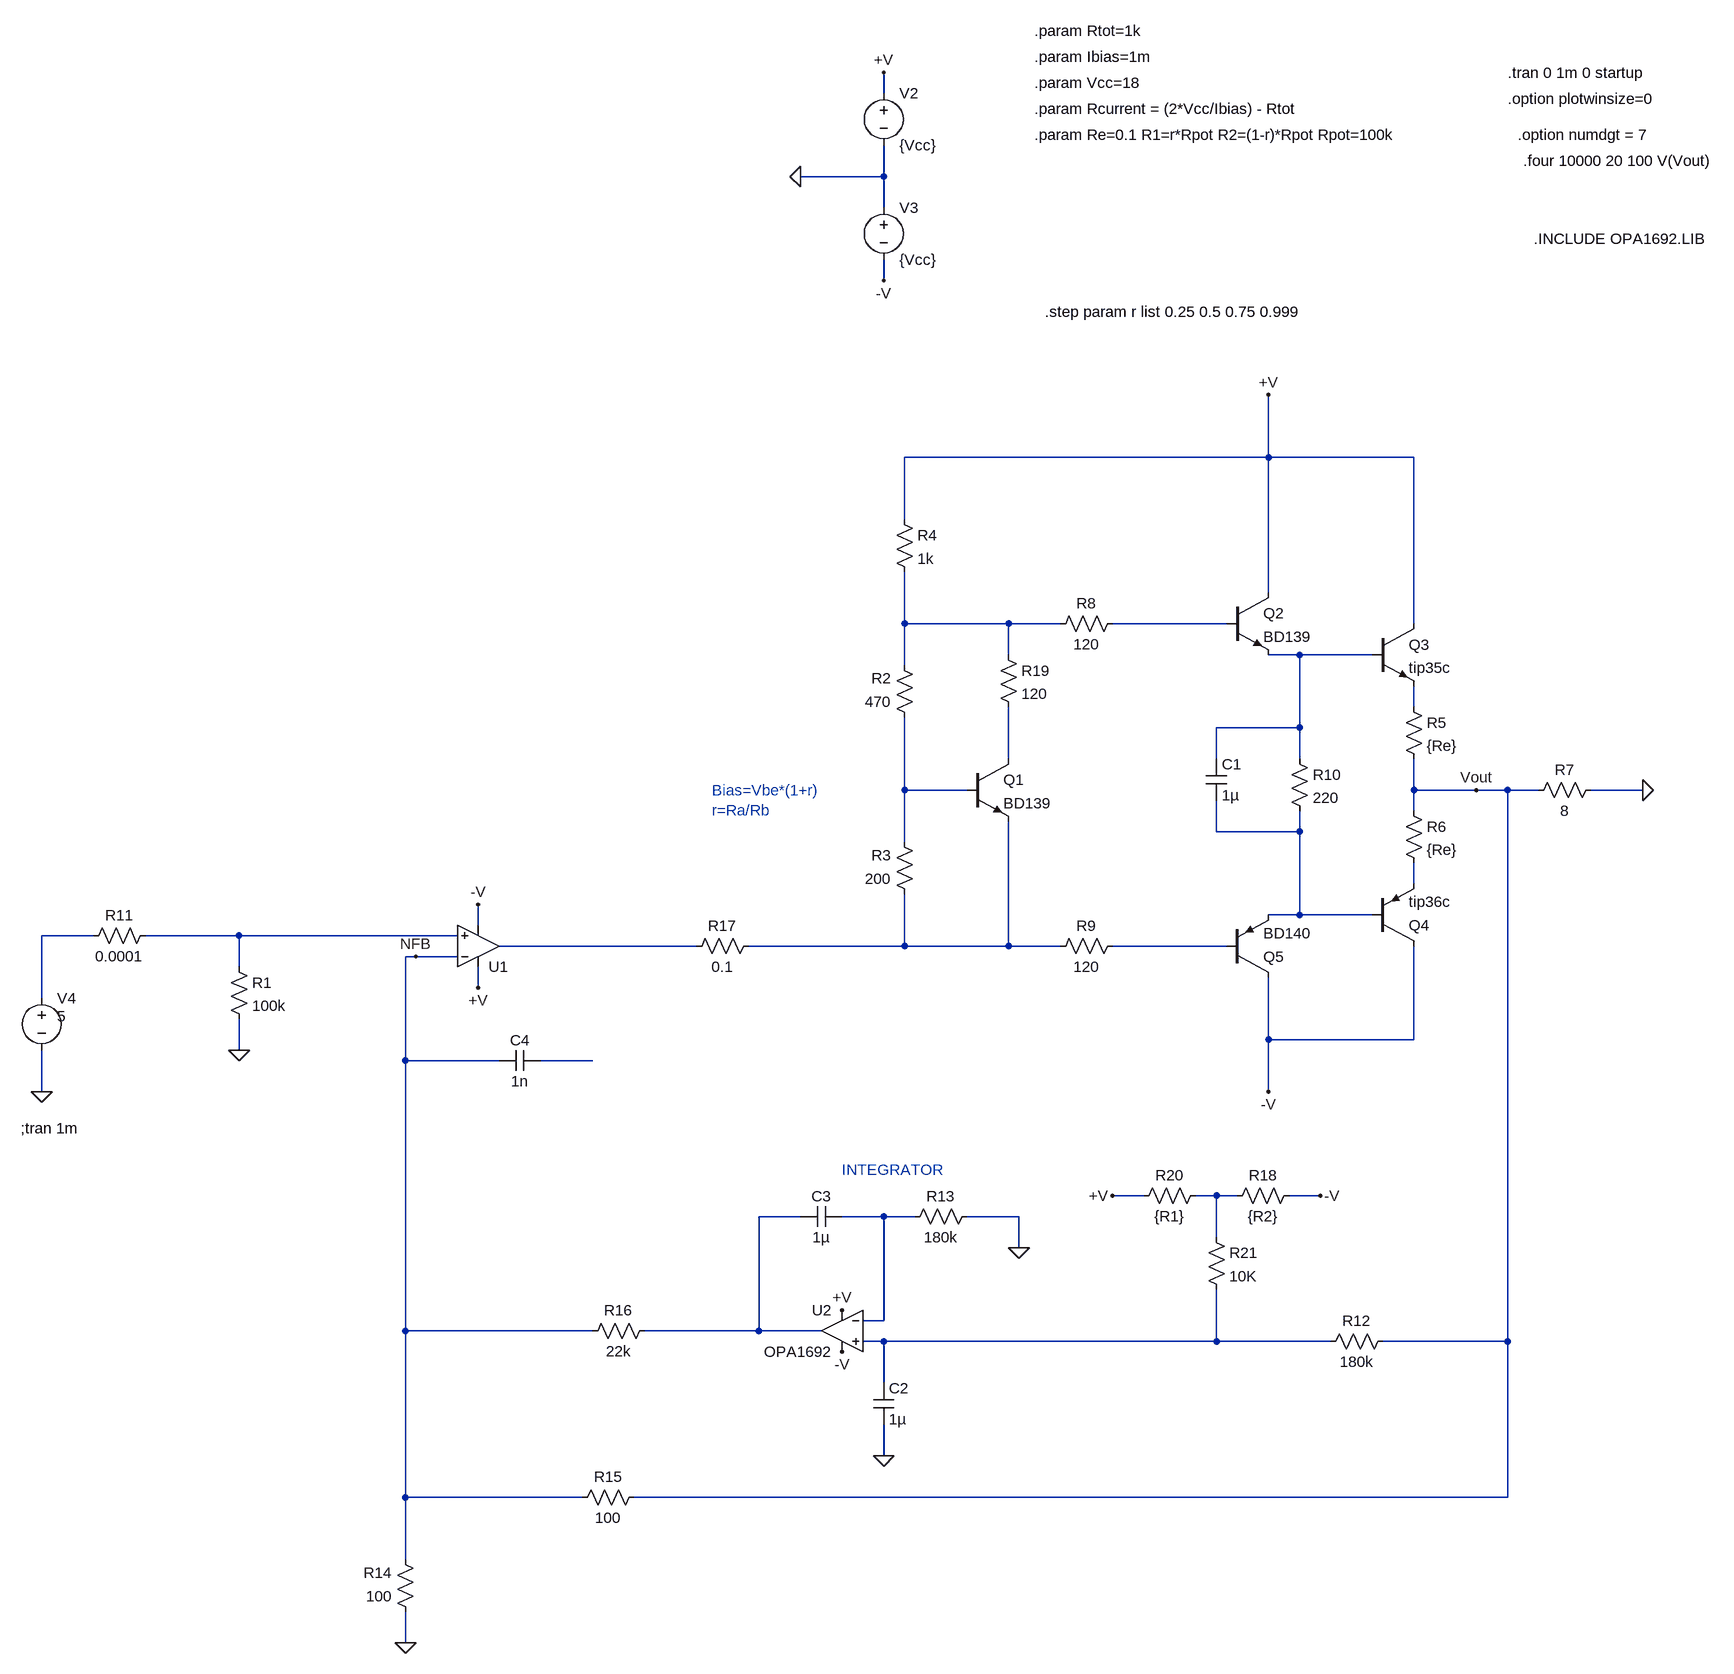
[diagram p0: schematic DC servo - trans.asc]
DC servo - trans.asc, the LTspice schematic file:
Version 4
SHEET 1 880 1380
WIRE -624 -1024 -624 -1056
WIRE -624 -896 -624 -944
WIRE -624 -896 -752 -896
WIRE -624 -848 -624 -896
WIRE -624 -736 -624 -768
WIRE -32 -464 -32 -560
WIRE -32 -464 -592 -464
WIRE 192 -464 -32 -464
WIRE -592 -368 -592 -464
WIRE -32 -256 -32 -464
WIRE -592 -208 -592 -288
WIRE -432 -208 -592 -208
WIRE -352 -208 -432 -208
WIRE -96 -208 -272 -208
WIRE 192 -208 192 -464
WIRE -432 -160 -432 -208
WIRE 16 -160 -32 -160
WIRE 128 -160 16 -160
WIRE -592 -144 -592 -208
WIRE 192 -80 192 -112
WIRE 16 -48 16 -160
WIRE 16 -48 -112 -48
WIRE -432 0 -432 -80
WIRE -112 0 -112 -48
WIRE 16 0 16 -48
WIRE -592 48 -592 -64
WIRE -496 48 -592 48
WIRE 192 48 192 0
WIRE 288 48 192 48
WIRE 336 48 288 48
WIRE 384 48 336 48
WIRE 544 48 464 48
WIRE 192 80 192 48
WIRE -112 112 -112 64
WIRE 16 112 16 80
WIRE 16 112 -112 112
WIRE -592 128 -592 48
WIRE 192 192 192 160
WIRE 16 240 16 112
WIRE 16 240 -32 240
WIRE 128 240 16 240
WIRE -1248 256 -1248 224
WIRE -1840 272 -1920 272
WIRE -1616 272 -1760 272
WIRE -1280 272 -1616 272
WIRE -912 288 -1216 288
WIRE -592 288 -592 208
WIRE -592 288 -832 288
WIRE -432 288 -432 96
WIRE -432 288 -592 288
WIRE -352 288 -432 288
WIRE -96 288 -272 288
WIRE -1344 304 -1360 304
WIRE -1280 304 -1344 304
WIRE -1616 320 -1616 272
WIRE -1248 352 -1248 320
WIRE -1920 368 -1920 272
WIRE -32 432 -32 336
WIRE 192 432 192 288
WIRE 192 432 -32 432
WIRE -1616 448 -1616 400
WIRE -1360 464 -1360 304
WIRE -1216 464 -1360 464
WIRE -1072 464 -1152 464
WIRE -1920 512 -1920 448
WIRE -32 512 -32 432
WIRE -224 672 -272 672
WIRE -112 672 -144 672
WIRE -80 672 -112 672
WIRE 48 672 0 672
WIRE -752 704 -816 704
WIRE -624 704 -688 704
WIRE -576 704 -624 704
WIRE -416 704 -496 704
WIRE -112 736 -112 672
WIRE -416 752 -416 704
WIRE -624 864 -624 704
WIRE -624 864 -656 864
WIRE -1360 880 -1360 464
WIRE -1072 880 -1360 880
WIRE -816 880 -816 704
WIRE -816 880 -992 880
WIRE -720 880 -816 880
WIRE -624 896 -656 896
WIRE -112 896 -112 816
WIRE -112 896 -624 896
WIRE 64 896 -112 896
WIRE 336 896 336 48
WIRE 336 896 144 896
WIRE -624 960 -624 896
WIRE -624 1072 -624 1024
WIRE -1360 1136 -1360 880
WIRE -1088 1136 -1360 1136
WIRE 336 1136 336 896
WIRE 336 1136 -1008 1136
WIRE -1360 1232 -1360 1136
WIRE -1360 1360 -1360 1312
FLAG -32 -560 +V
FLAG -32 512 -V
FLAG -752 -896 0
FLAG -624 -1056 +V
FLAG -624 -736 -V
FLAG 544 48 0
FLAG 288 48 Vout
FLAG -1920 512 0
FLAG -1248 352 +V
FLAG -1248 224 -V
FLAG -1616 448 0
FLAG -688 848 +V
FLAG -688 912 -V
FLAG -624 1072 0
FLAG -416 752 0
FLAG -1344 304 NFB
FLAG -1360 1360 0
FLAG -272 672 +V
FLAG 48 672 -V
SYMBOL res -576 -48 R180
WINDOW 0 36 76 Left 2
WINDOW 3 36 40 Left 2
SYMATTR InstName R2
SYMATTR Value 470
SYMBOL res -576 224 R180
WINDOW 0 36 76 Left 2
WINDOW 3 36 40 Left 2
SYMATTR InstName R3
SYMATTR Value 200
SYMBOL npn -496 0 R0
SYMATTR InstName Q1
SYMATTR Value BD139
SYMBOL npn -96 -256 R0
SYMATTR InstName Q2
SYMATTR Value BD139
SYMBOL npn 128 -208 R0
SYMATTR InstName Q3
SYMATTR Value tip35c
SYMBOL res -608 -384 R0
SYMATTR InstName R4
SYMATTR Value 1k
SYMBOL pnp 128 288 M180
SYMATTR InstName Q4
SYMATTR Value tip36c
SYMBOL pnp -96 336 M180
SYMATTR InstName Q5
SYMATTR Value BD140
SYMBOL res 176 -96 R0
SYMATTR InstName R5
SYMATTR Value {Re}
SYMBOL res 176 64 R0
SYMATTR InstName R6
SYMATTR Value {Re}
SYMBOL voltage -624 -1040 R0
WINDOW 123 0 0 Left 0
WINDOW 39 0 0 Left 0
SYMATTR InstName V2
SYMATTR Value {Vcc}
SYMBOL voltage -624 -864 R0
WINDOW 123 0 0 Left 0
WINDOW 39 0 0 Left 0
SYMATTR InstName V3
SYMATTR Value {Vcc}
SYMBOL res 480 32 R90
WINDOW 0 0 56 VBottom 2
WINDOW 3 32 56 VTop 2
SYMATTR InstName R7
SYMATTR Value 8
SYMBOL res -256 -224 R90
WINDOW 0 0 56 VBottom 2
WINDOW 3 32 56 VTop 2
SYMATTR InstName R8
SYMATTR Value 120
SYMBOL res -256 272 R90
WINDOW 0 0 56 VBottom 2
WINDOW 3 32 56 VTop 2
SYMATTR InstName R9
SYMATTR Value 120
SYMBOL res 0 -16 R0
SYMATTR InstName R10
SYMATTR Value 220
SYMBOL cap -128 0 R0
SYMATTR InstName C1
SYMATTR Value 1µ
SYMBOL OpAmps\\opamp2 -1248 352 M180
WINDOW 3 16 96 Invisible 2
SYMATTR Value OPA1692
SYMATTR InstName U1
SYMBOL voltage -1920 352 R0
WINDOW 123 24 124 Left 2
WINDOW 39 0 0 Left 0
WINDOW 3 24 44 Left 2
SYMATTR Value 5
SYMATTR InstName V4
SYMBOL res -1744 256 R90
WINDOW 0 0 56 VBottom 2
WINDOW 3 32 56 VTop 2
SYMATTR InstName R11
SYMATTR Value 0.0001
SYMBOL res -1632 304 R0
SYMATTR InstName R1
SYMATTR Value 100k
SYMBOL OpAmps\\opamp2 -688 816 M0
SYMATTR InstName U2
SYMATTR Value OPA1692
SYMBOL res 160 880 R90
WINDOW 0 0 56 VBottom 2
WINDOW 3 32 56 VTop 2
SYMATTR InstName R12
SYMATTR Value 180k
SYMBOL cap -640 960 R0
SYMATTR InstName C2
SYMATTR Value 1µ
SYMBOL cap -688 688 R90
WINDOW 0 0 32 VBottom 2
WINDOW 3 32 32 VTop 2
SYMATTR InstName C3
SYMATTR Value 1µ
SYMBOL res -480 688 R90
WINDOW 0 0 56 VBottom 2
WINDOW 3 32 56 VTop 2
SYMATTR InstName R13
SYMATTR Value 180k
SYMBOL res -1344 1328 R180
WINDOW 0 36 76 Left 2
WINDOW 3 36 40 Left 2
SYMATTR InstName R14
SYMATTR Value 100
SYMBOL res -992 1120 R90
WINDOW 0 0 56 VBottom 2
WINDOW 3 32 56 VTop 2
SYMATTR InstName R15
SYMATTR Value 100
SYMBOL res -976 864 R90
WINDOW 0 0 56 VBottom 2
WINDOW 3 32 56 VTop 2
SYMATTR InstName R16
SYMATTR Value 22k
SYMBOL res -816 272 R90
WINDOW 0 0 56 VBottom 2
WINDOW 3 32 56 VTop 2
SYMATTR InstName R17
SYMATTR Value 0.1
SYMBOL cap -1152 448 R90
WINDOW 0 0 32 VBottom 2
WINDOW 3 32 32 VTop 2
SYMATTR InstName C4
SYMATTR Value 1n
SYMBOL res -448 -176 R0
SYMATTR InstName R19
SYMATTR Value 120
SYMBOL res 16 656 R90
WINDOW 0 0 56 VBottom 2
WINDOW 3 32 56 VTop 2
SYMATTR InstName R18
SYMATTR Value {R2}
SYMBOL res -128 656 R90
WINDOW 0 0 56 VBottom 2
WINDOW 3 32 56 VTop 2
SYMATTR InstName R20
SYMATTR Value {R1}
SYMBOL res -128 720 R0
SYMATTR InstName R21
SYMATTR Value 10K
TEXT -888 48 Left 2 ;Bias=Vbe*(1+r)\nr=Ra/Rb
TEXT -392 -1120 Left 2 !.param Rtot=1k
TEXT -392 -1080 Left 2 !.param Ibias=1m
TEXT -392 -1040 Left 2 !.param Vcc=18
TEXT -392 -1000 Left 2 !.param Rcurrent = (2*Vcc/Ibias) - Rtot
TEXT -392 -960 Left 2 !.param Re=0.1 R1=r*Rpot R2=(1-r)*Rpot Rpot=100k
TEXT 336 -1056 Left 2 !.tran 0 1m 0 startup
TEXT 336 -1016 Left 2 !.option plotwinsize=0
TEXT 352 -960 Left 2 !.option numdgt = 7
TEXT 360 -920 Left 2 !.four 10000 20 100 V(Vout)
TEXT 376 -800 Left 2 !.INCLUDE OPA1692.LIB
TEXT -1952 568 Left 2 !;tran 1m
TEXT -688 632 Left 2 ;INTEGRATOR
TEXT -376 -688 Left 2 !.step param r list 0.25 0.5 0.75 0.999

The netlist it stands for:
* DC servo - trans.asc
R2 N006 N001 470
R3 N012 N006 200
Q1 N005 N006 N012 0 BD139
Q2 +V N002 N003 0 BD139
Q3 +V N003 N004 0 tip35c
R4 +V N001 1k
Q4 -V N007 N008 0 tip36c
Q5 -V N013 N007 0 BD140
R5 N004 Vout {Re}
R6 Vout N008 {Re}
V2 +V 0 {Vcc}
V3 0 -V {Vcc}
R7 0 Vout 8
R8 N002 N001 120
R9 N013 N012 120
R10 N003 N007 220
C1 N003 N007 1µ
XU1 N010 NFB +V -V N011 OPA1692  ; pins In+ In- V+ V- OUT
V4 N009 0 5
R11 N010 N009 0.0001
R1 N010 0 100k
XU2 N018 N017 +V -V N016 OPA1692  ; pins In+ In- V+ V- OUT
R12 Vout N018 180k
C2 N018 0 1µ
C3 N017 N016 1µ
R13 0 N017 180k
R14 0 NFB 100
R15 Vout NFB 100
R16 N016 NFB 22k
R17 N012 N011 0.1
C4 N014 NFB 1n
R19 N001 N005 120
R18 -V N015 {R2}
R20 N015 +V {R1}
R21 N015 N018 10K
.model NPN NPN
.model PNP PNP
.lib standard.bjt
* Bias=Vbe*(1+r)
* r=Ra/Rb
.param Rtot=1k
.param Ibias=1m
.param Vcc=18
.param Rcurrent = (2*Vcc/Ibias) - Rtot
.param Re=0.1 R1=r*Rpot R2=(1-r)*Rpot Rpot=100k
.tran 0 1m 0 startup
.option plotwinsize=0
.option numdgt = 7
.four 10000 20 100 V(Vout)
.INCLUDE OPA1692.LIB
;tran 1m
* INTEGRATOR
.step param r list 0.25 0.5 0.75 0.999
.backanno
.end